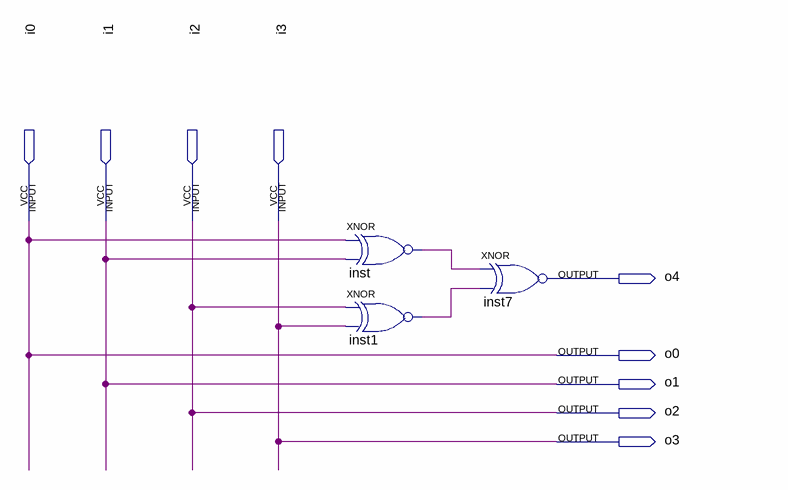
[diagram p0: schematic sheet]
// Quartus schematic odd_parity.bdf as structural Verilog: 3 symbols, 9 pins
module odd_parity (
  input  i0,
  input  i1,
  input  i2,
  input  i3,
  output o4,
  output o0,
  output o1,
  output o2,
  output o3
);

  wire inst1_out, inst_out;

  xnor inst (inst_out, i0, i1);
  xnor inst1 (inst1_out, i2, i3);
  xnor inst7 (o4, inst_out, inst1_out);

  assign o0 = i0;
  assign o1 = i1;
  assign o2 = i2;
  assign o3 = i3;
endmodule
